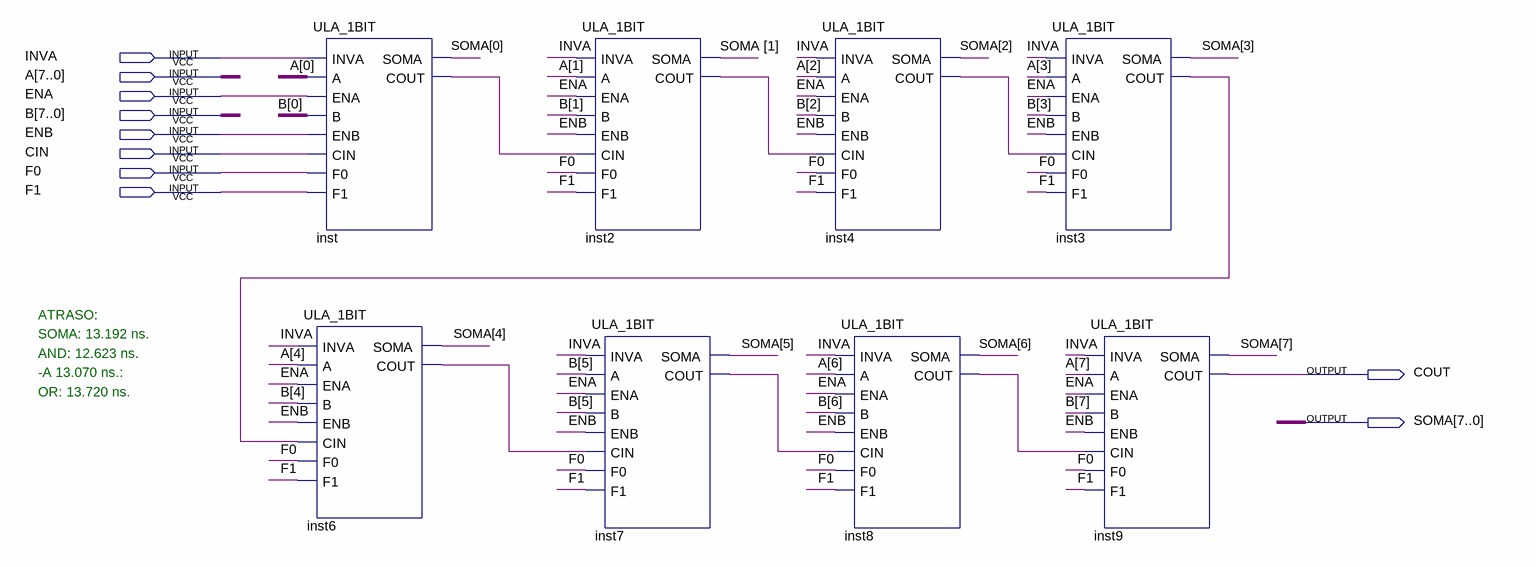
[diagram p0: schematic sheet]
// Quartus schematic ULA_8BIT.bdf as structural Verilog: 8 symbols, 10 pins
module ULA_8BIT (
  input  INVA,
  input  [7:0] A,
  input  ENA,
  input  [7:0] B,
  input  ENB,
  input  CIN,
  input  F0,
  input  F1,
  output COUT,
  output [7:0] SOMA
);

  wire inst2_cout, inst3_cout, inst4_cout, inst6_cout, inst7_cout, inst8_cout, inst_cout;

  ULA_1BIT inst (
    .INVA(INVA), .A(A[0]), .ENA(ENA), .B(B[0]), .ENB(ENB), .CIN(CIN), .F0(F0), .F1(F1), .SOMA(SOMA[0]),
    .COUT(inst_cout));
  ULA_1BIT inst6 (
    .INVA(INVA), .A(A[4]), .ENA(ENA), .B(B[4]), .ENB(ENB), .CIN(inst3_cout), .F0(F0), .F1(F1),
    .SOMA(SOMA[4]), .COUT(inst6_cout));
  ULA_1BIT inst2 (
    .INVA(INVA), .A(A[1]), .ENA(ENA), .B(B[1]), .ENB(ENB), .CIN(inst_cout), .F0(F0), .F1(F1), .SOMA(SOMA[1]),
    .COUT(inst2_cout));
  ULA_1BIT inst7 (
    .INVA(INVA), .A(B[5]), .ENA(ENA), .B(B[5]), .ENB(ENB), .CIN(inst6_cout), .F0(F0), .F1(F1),
    .SOMA(SOMA[5]), .COUT(inst7_cout));
  ULA_1BIT inst4 (
    .INVA(INVA), .A(A[2]), .ENA(ENA), .B(B[2]), .ENB(ENB), .CIN(inst2_cout), .F0(F0), .F1(F1),
    .SOMA(SOMA[2]), .COUT(inst4_cout));
  ULA_1BIT inst8 (
    .INVA(INVA), .A(A[6]), .ENA(ENA), .B(B[6]), .ENB(ENB), .CIN(inst7_cout), .F0(F0), .F1(F1),
    .SOMA(SOMA[6]), .COUT(inst8_cout));
  ULA_1BIT inst3 (
    .INVA(INVA), .A(A[3]), .ENA(ENA), .B(B[3]), .ENB(ENB), .CIN(inst4_cout), .F0(F0), .F1(F1),
    .SOMA(SOMA[3]), .COUT(inst3_cout));
  ULA_1BIT inst9 (
    .INVA(INVA), .A(A[7]), .ENA(ENA), .B(B[7]), .ENB(ENB), .CIN(inst8_cout), .F0(F0), .F1(F1),
    .SOMA(SOMA[7]), .COUT(COUT));

  // Notes on the sheet:
  //   ATRASO:
  //   SOMA: 13.192 ns.
  //   AND: 12.623 ns.
  //   -A 13.070 ns.:
  //   OR: 13.720 ns.
endmodule
